# EAGLE schematic Ringo3-Eagle6 (EAGLE 6.2)
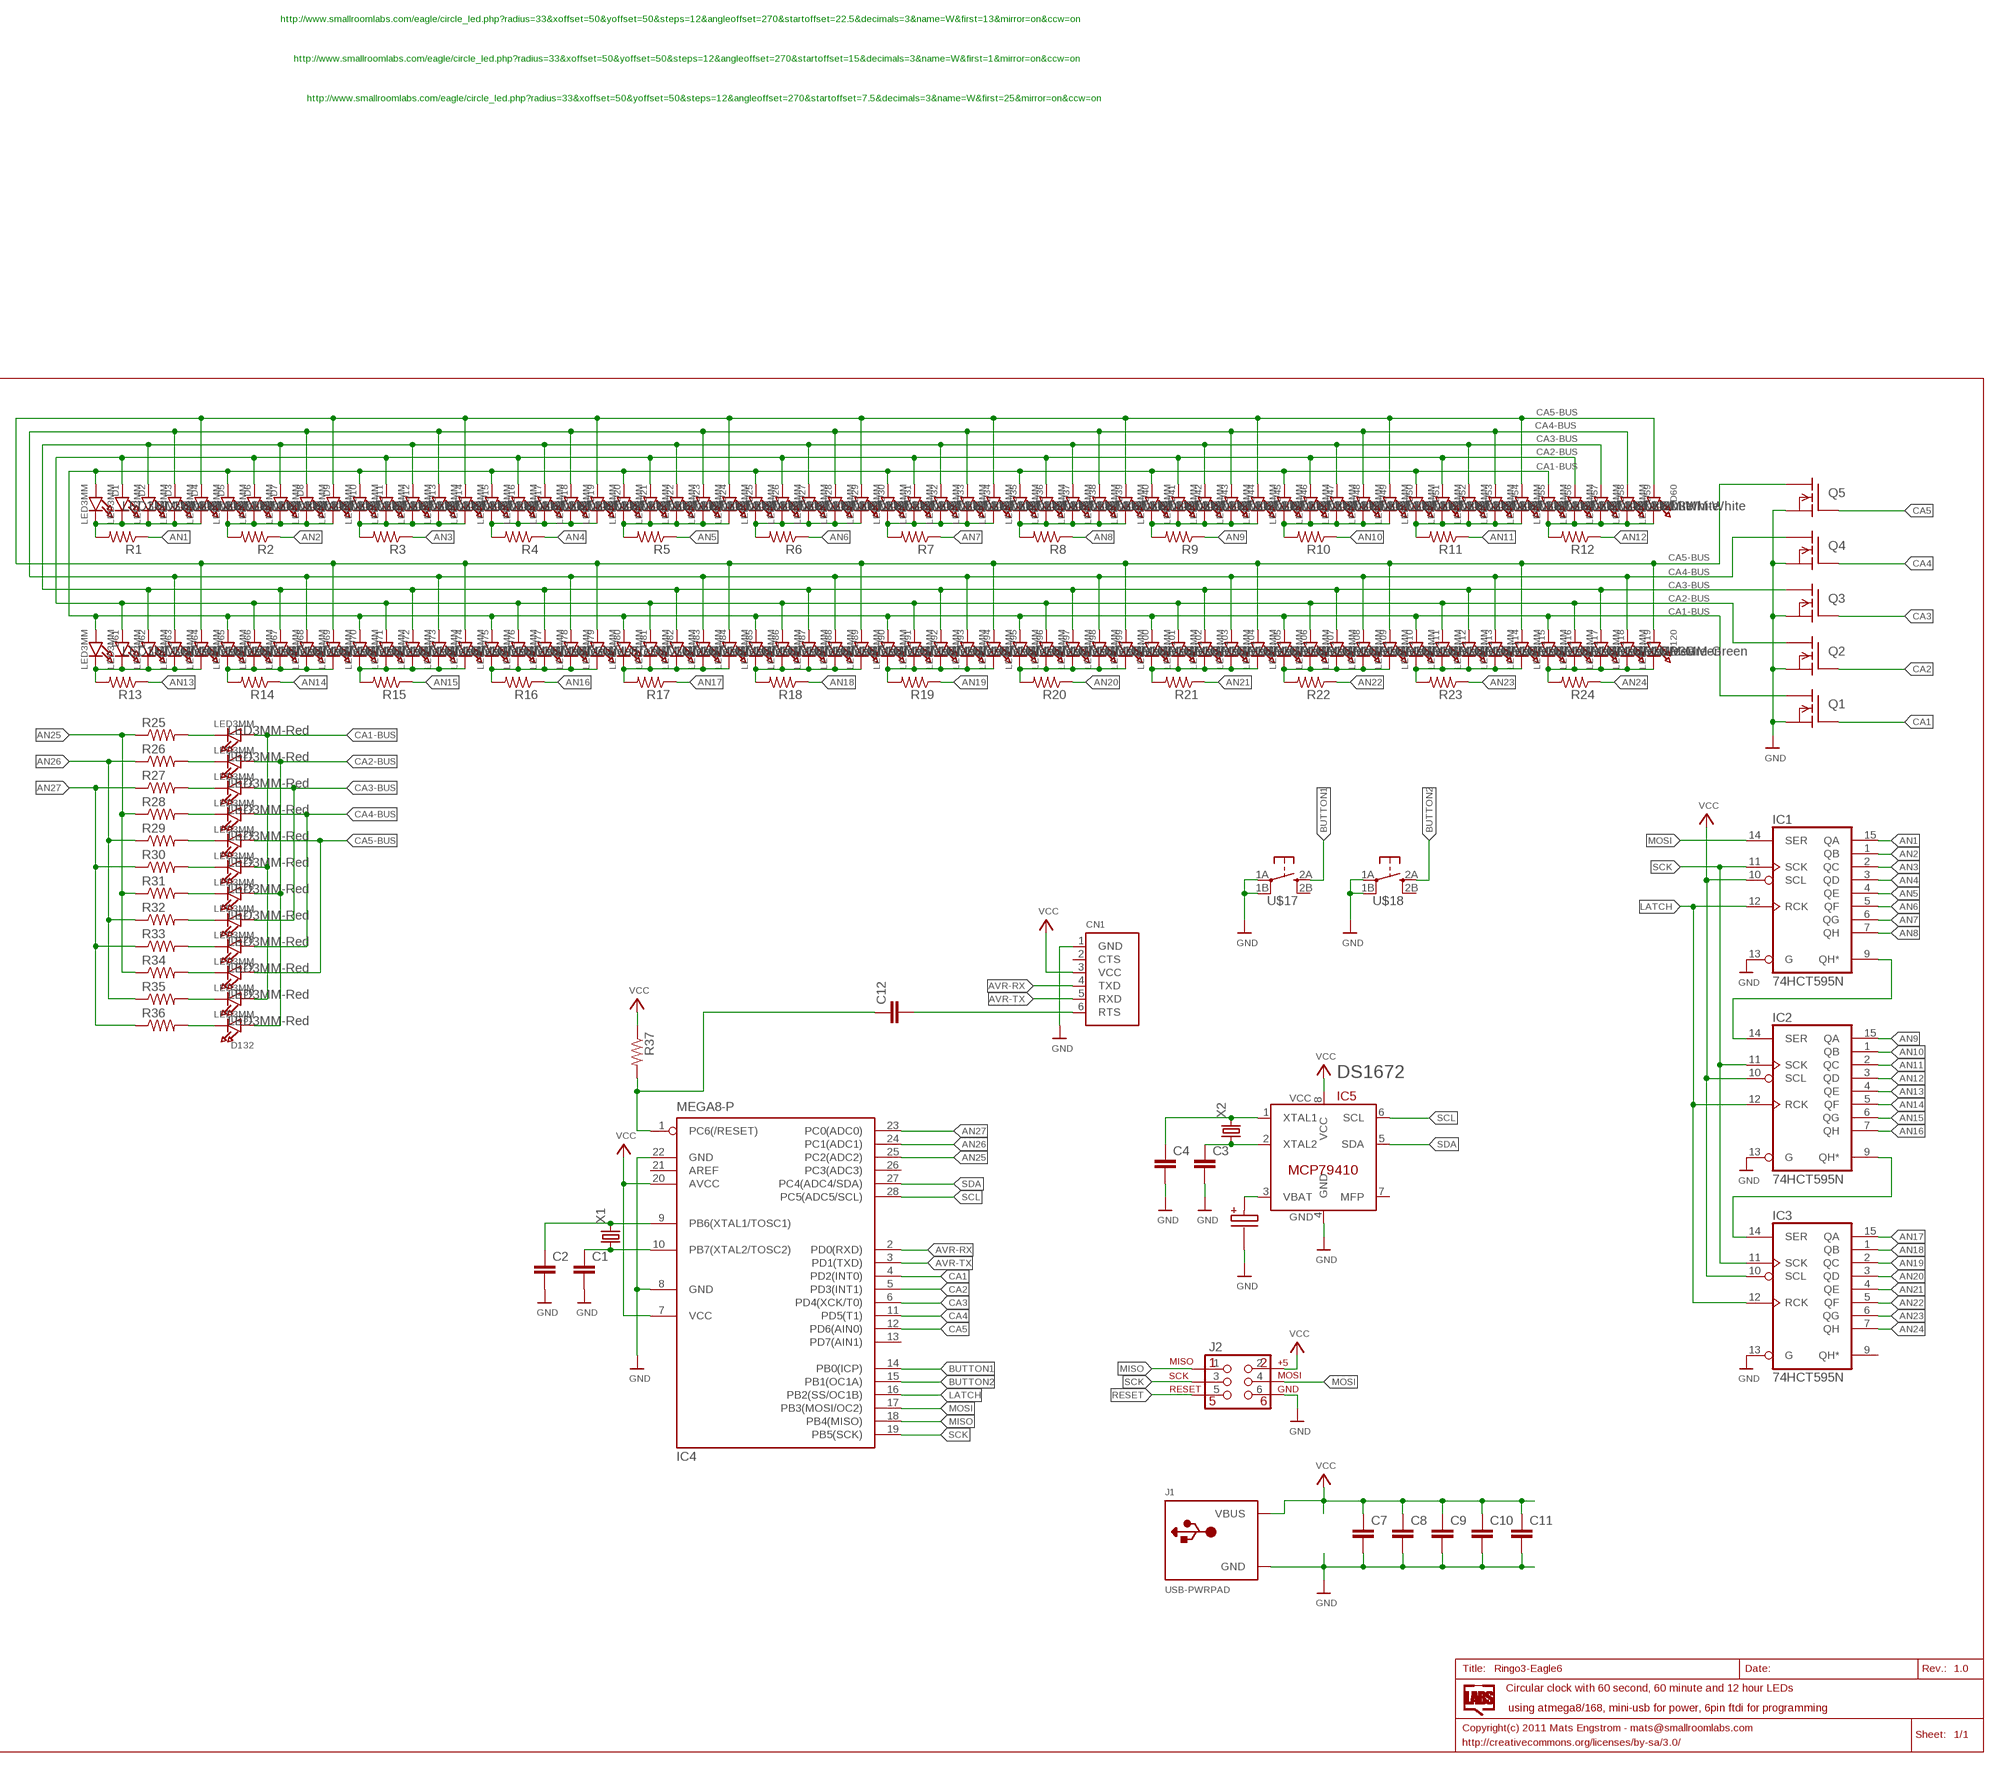
[diagram p0: schematic, sheet 1, part 1 of 2]
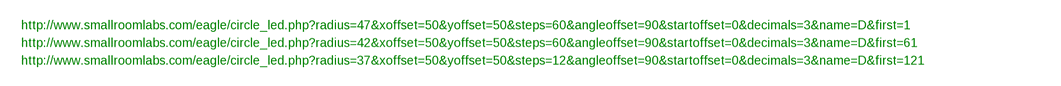
[diagram p1: schematic, sheet 1, part 2 of 2]

## Parts
C1  CAPPTH  [CAP-PTH-SMALL]
C2  CAPPTH  [CAP-PTH-SMALL]
C3  CAPPTH  [CAP-PTH-SMALL]
C4  CAPPTH  [CAP-PTH-SMALL]
C5  CAPPOLSUPER13/5  [CAP-SUPER13/5]
C7  CAPPTH  [CAP-PTH-SMALL]
C8  CAPPTH  [CAP-PTH-SMALL]
C9  CAPPTH  [CAP-PTH-SMALL]
C10  CAPPTH  [CAP-PTH-SMALL]
C11  CAPPTH  [CAP-PTH-SMALL]
C12  CAPPTH  [CAP-PTH-SMALL]
CN1  FTDIUSBCABLE  [1X06_ROUND]
D1  LED3MM  [LED3MM]
D2  LED3MM  [LED3MM]
D3  LED3MM  [LED3MM]
D4  LED3MM  [LED3MM]
D5  LED3MM  [LED3MM]
D6  LED3MM  [LED3MM]
D7  LED3MM  [LED3MM]
D8  LED3MM  [LED3MM]
D9  LED3MM  [LED3MM]
D10  LED3MM  [LED3MM]
D11  LED3MM  [LED3MM]
D12  LED3MM  [LED3MM]
D13  LED3MM  [LED3MM]
D14  LED3MM  [LED3MM]
D15  LED3MM  [LED3MM]
D16  LED3MM  [LED3MM]
D17  LED3MM  [LED3MM]
D18  LED3MM  [LED3MM]
D19  LED3MM  [LED3MM]
D20  LED3MM  [LED3MM]
D21  LED3MM  [LED3MM]
D22  LED3MM  [LED3MM]
D23  LED3MM  [LED3MM]
D24  LED3MM  [LED3MM]
D25  LED3MM  [LED3MM]
D26  LED3MM  [LED3MM]
D27  LED3MM  [LED3MM]
D28  LED3MM  [LED3MM]
D29  LED3MM  [LED3MM]
D30  LED3MM  [LED3MM]
D31  LED3MM  [LED3MM]
D32  LED3MM  [LED3MM]
D33  LED3MM  [LED3MM]
D34  LED3MM  [LED3MM]
D35  LED3MM  [LED3MM]
D36  LED3MM  [LED3MM]
D37  LED3MM  [LED3MM]
D38  LED3MM  [LED3MM]
D39  LED3MM  [LED3MM]
D40  LED3MM  [LED3MM]
D41  LED3MM  [LED3MM]
D42  LED3MM  [LED3MM]
D43  LED3MM  [LED3MM]
D44  LED3MM  [LED3MM]
D45  LED3MM  [LED3MM]
D46  LED3MM  [LED3MM]
D47  LED3MM  [LED3MM]
D48  LED3MM  [LED3MM]
D49  LED3MM  [LED3MM]
D50  LED3MM  [LED3MM]
D51  LED3MM  [LED3MM]
D52  LED3MM  [LED3MM]
D53  LED3MM  [LED3MM]
D54  LED3MM  [LED3MM]
D55  LED3MM  [LED3MM]
D56  LED3MM  [LED3MM]
D57  LED3MM  [LED3MM]
D58  LED3MM  [LED3MM]
D59  LED3MM  [LED3MM]
D60  LED3MM  [LED3MM]
D61  LED3MM  [LED3MM]
D62  LED3MM  [LED3MM]
D63  LED3MM  [LED3MM]
D64  LED3MM  [LED3MM]
D65  LED3MM  [LED3MM]
D66  LED3MM  [LED3MM]
D67  LED3MM  [LED3MM]
D68  LED3MM  [LED3MM]
D69  LED3MM  [LED3MM]
D70  LED3MM  [LED3MM]
D71  LED3MM  [LED3MM]
D72  LED3MM  [LED3MM]
D73  LED3MM  [LED3MM]
D74  LED3MM  [LED3MM]
D75  LED3MM  [LED3MM]
D76  LED3MM  [LED3MM]
D77  LED3MM  [LED3MM]
D78  LED3MM  [LED3MM]
D79  LED3MM  [LED3MM]
D80  LED3MM  [LED3MM]
D81  LED3MM  [LED3MM]
D82  LED3MM  [LED3MM]
D83  LED3MM  [LED3MM]
D84  LED3MM  [LED3MM]
D85  LED3MM  [LED3MM]
D86  LED3MM  [LED3MM]
D87  LED3MM  [LED3MM]
D88  LED3MM  [LED3MM]
D89  LED3MM  [LED3MM]
D90  LED3MM  [LED3MM]
D91  LED3MM  [LED3MM]
D92  LED3MM  [LED3MM]
D93  LED3MM  [LED3MM]
D94  LED3MM  [LED3MM]
D95  LED3MM  [LED3MM]
D96  LED3MM  [LED3MM]
D97  LED3MM  [LED3MM]
D98  LED3MM  [LED3MM]
D99  LED3MM  [LED3MM]
D100  LED3MM  [LED3MM]
D101  LED3MM  [LED3MM]
D102  LED3MM  [LED3MM]
D103  LED3MM  [LED3MM]
D104  LED3MM  [LED3MM]
D105  LED3MM  [LED3MM]
D106  LED3MM  [LED3MM]
D107  LED3MM  [LED3MM]
D108  LED3MM  [LED3MM]
D109  LED3MM  [LED3MM]
D110  LED3MM  [LED3MM]
D111  LED3MM  [LED3MM]
D112  LED3MM  [LED3MM]
D113  LED3MM  [LED3MM]
D114  LED3MM  [LED3MM]
D115  LED3MM  [LED3MM]
D116  LED3MM  [LED3MM]
D117  LED3MM  [LED3MM]
D118  LED3MM  [LED3MM]
D119  LED3MM  [LED3MM]
D120  LED3MM  [LED3MM]
D121  LED3MM  [LED3MM]
D122  LED3MM  [LED3MM]
D123  LED3MM  [LED3MM]
D124  LED3MM  [LED3MM]
D125  LED3MM  [LED3MM]
D126  LED3MM  [LED3MM]
D127  LED3MM  [LED3MM]
D128  LED3MM  [LED3MM]
D129  LED3MM  [LED3MM]
D130  LED3MM  [LED3MM]
D131  LED3MM  [LED3MM]
D132  LED3MM  [LED3MM]
IC1  74HCT595N  [DIL16]
IC2  74HCT595N  [DIL16]
IC3  74HCT595N  [DIL16]
IC4  MEGA8-P  [DIL28-3]
IC5  MCP79410DIL  [DIL08-LONG]
J1  USB-PWRPAD  [USB-MINIB-PTH-PWR-PAD]
J2  AVR-ISP6_TOUCH  [ISP-TOUCH]
Q1  N-FETSTR  [TO92-STRAIGHT]
Q2  N-FETSTR  [TO92-STRAIGHT]
Q3  N-FETSTR  [TO92-STRAIGHT]
Q4  N-FETSTR  [TO92-STRAIGHT]
Q5  N-FETSTR  [TO92-STRAIGHT]
R1  RESISTORAXIAL-0.3  [AXIAL-0.3]
R2  RESISTORAXIAL-0.3  [AXIAL-0.3]
R3  RESISTORAXIAL-0.3  [AXIAL-0.3]
R4  RESISTORAXIAL-0.3  [AXIAL-0.3]
R5  RESISTORAXIAL-0.3  [AXIAL-0.3]
R6  RESISTORAXIAL-0.3  [AXIAL-0.3]
R7  RESISTORAXIAL-0.3  [AXIAL-0.3]
R8  RESISTORAXIAL-0.3  [AXIAL-0.3]
R9  RESISTORAXIAL-0.3  [AXIAL-0.3]
R10  RESISTORAXIAL-0.3  [AXIAL-0.3]
R11  RESISTORAXIAL-0.3  [AXIAL-0.3]
R12  RESISTORAXIAL-0.3  [AXIAL-0.3]
R13  RESISTORAXIAL-0.3  [AXIAL-0.3]
R14  RESISTORAXIAL-0.3  [AXIAL-0.3]
R15  RESISTORAXIAL-0.3  [AXIAL-0.3]
R16  RESISTORAXIAL-0.3  [AXIAL-0.3]
R17  RESISTORAXIAL-0.3  [AXIAL-0.3]
R18  RESISTORAXIAL-0.3  [AXIAL-0.3]
R19  RESISTORAXIAL-0.3  [AXIAL-0.3]
R20  RESISTORAXIAL-0.3  [AXIAL-0.3]
R21  RESISTORAXIAL-0.3  [AXIAL-0.3]
R22  RESISTORAXIAL-0.3  [AXIAL-0.3]
R23  RESISTORAXIAL-0.3  [AXIAL-0.3]
R24  RESISTORAXIAL-0.3  [AXIAL-0.3]
R25  RESISTORAXIAL-0.3  [AXIAL-0.3]
R26  RESISTORAXIAL-0.3  [AXIAL-0.3]
R27  RESISTORAXIAL-0.3  [AXIAL-0.3]
R28  RESISTORAXIAL-0.3  [AXIAL-0.3]
R29  RESISTORAXIAL-0.3  [AXIAL-0.3]
R30  RESISTORAXIAL-0.3  [AXIAL-0.3]
R31  RESISTORAXIAL-0.3  [AXIAL-0.3]
R32  RESISTORAXIAL-0.3  [AXIAL-0.3]
R33  RESISTORAXIAL-0.3  [AXIAL-0.3]
R34  RESISTORAXIAL-0.3  [AXIAL-0.3]
R35  RESISTORAXIAL-0.3  [AXIAL-0.3]
R36  RESISTORAXIAL-0.3  [AXIAL-0.3]
R37  RESISTORAXIAL-0.3  [AXIAL-0.3]
U$17  TACTILETACT-4.5X4.5-PTH  [TACTILE-PTH-4.5X4.5]
U$18  TACTILETACT-4.5X4.5-PTH  [TACTILE-PTH-4.5X4.5]
X1  CRYSTALHC49US  [HC49US]
X2  CRYSTALTC26H  [TC26H]

## Nets
AN1: IC1.15(QA) R1.P$1
AN2: IC1.1(QB) R2.P$1
AN3: IC1.2(QC) R3.P$1
AN4: IC1.3(QD) R4.P$1
AN5: IC1.4(QE) R5.P$1
AN6: IC1.5(QF) R6.P$1
AN7: IC1.6(QG) R7.P$1
AN8: IC1.7(QH) R8.P$1
AN9: IC2.15(QA) R9.P$1
AN10: IC2.1(QB) R10.P$1
AN11: IC2.2(QC) R11.P$1
AN12: IC2.3(QD) R12.P$1
AN13: IC2.4(QE) R13.P$1
AN14: IC2.5(QF) R14.P$1
AN15: IC2.6(QG) R15.P$1
AN16: IC2.7(QH) R16.P$1
AN17: IC3.15(QA) R17.P$1
AN18: IC3.1(QB) R18.P$1
AN19: IC3.2(QC) R19.P$1
AN20: IC3.3(QD) R20.P$1
AN21: IC3.4(QE) R21.P$1
AN22: IC3.5(QF) R22.P$1
AN23: IC3.6(QG) R23.P$1
AN24: IC3.7(QH) R24.P$1
AN25: IC4.25(PC2(ADC2)) R25.P$1 R28.P$1 R31.P$1 R34.P$1
AN26: IC4.24(PC1(ADC1)) R26.P$1 R29.P$1 R32.P$1 R35.P$1
AN27: IC4.23(PC0(ADC0)) R27.P$1 R30.P$1 R33.P$1 R36.P$1
AVR-RX: CN1.4(TXD) IC4.2(PD0(RXD))
AVR-TX: CN1.5(RXD) IC4.3(PD1(TXD))
BUTTON1: IC4.14(PB0(ICP)) U$17.2A
BUTTON2: IC4.15(PB1(OC1A)) U$18.2A
CA1: IC4.4(PD2(INT0)) Q1.2(G)
CA1-BUS: D1.A D6.A D11.A D16.A D21.A D26.A D31.A D36.A D41.A D46.A D51.A D56.A D61.A D66.A D71.A D76.A D81.A D86.A D91.A D96.A D101.A D106.A D111.A D116.A D121.A D126.A D131.A Q1.3(D)
CA2: IC4.5(PD3(INT1)) Q2.2(G)
CA2-BUS: D2.A D7.A D12.A D17.A D22.A D27.A D32.A D37.A D42.A D47.A D52.A D57.A D62.A D67.A D72.A D77.A D82.A D87.A D92.A D97.A D102.A D107.A D112.A D117.A D122.A D127.A D132.A Q2.3(D)
CA3: IC4.6(PD4(XCK/T0)) Q3.2(G)
CA3-BUS: D3.A D8.A D13.A D18.A D23.A D28.A D33.A D38.A D43.A D48.A D53.A D58.A D63.A D68.A D73.A D78.A D83.A D88.A D93.A D98.A D103.A D108.A D113.A D118.A D123.A D128.A Q3.3(D)
CA4: IC4.11(PD5(T1)) Q4.2(G)
CA4-BUS: D4.A D9.A D14.A D19.A D24.A D29.A D34.A D39.A D44.A D49.A D54.A D59.A D64.A D69.A D74.A D79.A D84.A D89.A D94.A D99.A D104.A D109.A D114.A D119.A D124.A D129.A Q4.3(D)
CA5: IC4.12(PD6(AIN0)) Q5.2(G)
CA5-BUS: D5.A D10.A D15.A D20.A D25.A D30.A D35.A D40.A D45.A D50.A D55.A D60.A D65.A D70.A D75.A D80.A D85.A D90.A D95.A D100.A D105.A D110.A D115.A D120.A D125.A D130.A Q5.3(D)
DATA1: IC1.9(QH*) IC2.14(SER)
DATA2: IC2.9(QH*) IC3.14(SER)
GND [power]: C1.2 C2.2 C3.2 C4.2 C5.C C7.2 C8.2 C9.2 C10.2 C11.2 CN1.1(GND) IC1.13(G) IC2.13(G) IC3.13(G) IC4.8(GND) IC4.22(GND) IC5.4(GND) J1.GND J2.6(GND) Q1.1(S) Q2.1(S) Q3.1(S) Q4.1(S) Q5.1(S) U$17.1A U$17.1B U$18.1A U$18.1B
LATCH: IC1.12(RCK) IC2.12(RCK) IC3.12(RCK) IC4.16(PB2(SS/OC1B))
MISO: IC4.18(PB4(MISO)) J2.1(MISO)
MOSI: IC1.14(SER) IC4.17(PB3(MOSI/OC2)) J2.4(MOSI)
N$1: D1.C D2.C D3.C D4.C D5.C R1.P$2
N$2: D6.C D7.C D8.C D9.C D10.C R2.P$2
N$3: D21.C D22.C D23.C D24.C D25.C R5.P$2
N$4: D26.C D27.C D28.C D29.C D30.C R6.P$2
N$5: D31.C D32.C D33.C D34.C D35.C R7.P$2
N$6: D36.C D37.C D38.C D39.C D40.C R8.P$2
N$7: D11.C D12.C D13.C D14.C D15.C R3.P$2
N$8: D16.C D17.C D18.C D19.C D20.C R4.P$2
N$9: D41.C D42.C D43.C D44.C D45.C R9.P$2
N$10: D46.C D47.C D48.C D49.C D50.C R10.P$2
N$11: D51.C D52.C D53.C D54.C D55.C R11.P$2
N$12: D56.C D57.C D58.C D59.C D60.C R12.P$2
N$13: D116.C D117.C D118.C D119.C D120.C R24.P$2
N$14: D111.C D112.C D113.C D114.C D115.C R23.P$2
N$15: D106.C D107.C D108.C D109.C D110.C R22.P$2
N$16: D101.C D102.C D103.C D104.C D105.C R21.P$2
N$17: D96.C D97.C D98.C D99.C D100.C R20.P$2
N$18: C3.1 IC5.2(XTAL2) X2.1
N$19: D91.C D92.C D93.C D94.C D95.C R19.P$2
N$20: D86.C D87.C D88.C D89.C D90.C R18.P$2
N$21: D66.C D67.C D68.C D69.C D70.C R14.P$2
N$22: D71.C D72.C D73.C D74.C D75.C R15.P$2
N$23: D76.C D77.C D78.C D79.C D80.C R16.P$2
N$24: D81.C D82.C D83.C D84.C D85.C R17.P$2
N$25: D61.C D62.C D63.C D64.C D65.C R13.P$2
N$26: C4.1 IC5.1(XTAL1) X2.2
N$27: C12.2 CN1.6(RTS)
N$28: C5.A IC5.3(VBAT)
N$54: D121.C R25.P$2
N$55: D122.C R26.P$2
N$56: D123.C R27.P$2
N$57: D124.C R28.P$2
N$58: D125.C R29.P$2
N$59: D126.C R30.P$2
N$60: D127.C R31.P$2
N$61: D128.C R32.P$2
N$62: D129.C R33.P$2
N$63: D130.C R34.P$2
N$64: D131.C R35.P$2
N$65: D132.C R36.P$2
RESET: C12.1 IC4.1(PC6(/RESET)) J2.5(RESET) R37.P$2
SCK: IC1.11(SCK) IC2.11(SCK) IC3.11(SCK) IC4.19(PB5(SCK)) J2.3(SCK)
SCL: IC4.28(PC5(ADC5/SCL)) IC5.6(SCL)
SDA: IC4.27(PC4(ADC4/SDA)) IC5.5(SDA)
VCC [power]: C7.1 C8.1 C9.1 C10.1 C11.1 CN1.3(VCC) IC1.10(SCL) IC2.10(SCL) IC3.10(SCL) IC4.7(VCC) IC4.20(AVCC) IC5.8(VCC) J1.VBUS J2.2(V+) R37.P$1
XTAL1: C2.1 IC4.9(PB6(XTAL1/TOSC1)) X1.2
XTAL2: C1.1 IC4.10(PB7(XTAL2/TOSC2)) X1.1
Unconnected: CN1.2(CTS) IC3.9(QH*) IC4.13(PD7(AIN1)) IC4.21(AREF) IC4.26(PC3(ADC3)) IC5.7(MFP) U$17.2B U$18.2B

## Notes on the sheet
- http://www.smallroomlabs.com/eagle/circle_led.php?radius=33&xoffset=50&yoffset=50&steps=12&angleoffset=270&startoffset=22.5&decimals=3&name=W&first=13&mirror=on&ccw=on
- http://www.smallroomlabs.com/eagle/circle_led.php?radius=33&xoffset=50&yoffset=50&steps=12&angleoffset=270&startoffset=15&decimals=3&name=W&first=1&mirror=on&ccw=on
- http://www.smallroomlabs.com/eagle/circle_led.php?radius=33&xoffset=50&yoffset=50&steps=12&angleoffset=270&startoffset=7.5&decimals=3&name=W&first=25&mirror=on&ccw=on
- http://www.smallroomlabs.com/eagle/circle_led.php?radius=47&xoffset=50&yoffset=50&steps=60&angleoffset=90&startoffset=0&decimals=3&name=D&first=1
- http://www.smallroomlabs.com/eagle/circle_led.php?radius=42&xoffset=50&yoffset=50&steps=60&angleoffset=90&startoffset=0&decimals=3&name=D&first=61
- http://www.smallroomlabs.com/eagle/circle_led.php?radius=37&xoffset=50&yoffset=50&steps=12&angleoffset=90&startoffset=0&decimals=3&name=D&first=121
- DS1672
- Circular clock with 60 second, 60 minute and 12 hour LEDs
- using atmega8/168, mini-usb for power, 6pin ftdi for programming

## Power pins joined to a net without a drawn wire
GND: IC1.8(GND) IC2.8(GND) IC3.8(GND)
VCC: IC1.16(VCC) IC2.16(VCC) IC3.16(VCC)

## Library data of the parts
C1-C4 C7-C12 = SparkFun:CAP: Capacitor Standard 0603 ceramic capacitor, and 0.1" leaded capacitor.; EAGLEUP: CapSq2.54
C5 = SmallRoomLabs:CAPPOL
CN1 = microbuilder:FTDIUSBCABLE: FTDI TTL-232R USB Cable Connector for FTDI's USB->RS232 Cable
D1-D60 = SmallRoomLabs:LED; EAGLEUP: LED3MM-White
D61-D79 D81-D120 = SmallRoomLabs:LED; EAGLEUP: LED3MM-Green
D80 = SmallRoomLabs:LED
D121-D132 = SmallRoomLabs:LED; EAGLEUP: LED3MM-Red
IC1-IC3 = 74xx-eu:74*595: 8-bit SHIFT REGISTER, output latch
IC4 = atmel:MEGA8-P: MICROCONTROLLER 8 Kbytes FLASH, 1 kbytes SRAM, 512 bytes EEPROM, USART, 4-channel 10 bit ADC, 2-channel 8 bit ADC Pin compatible with Atmega48, ATMega88, ATMega168 Source: avr.lbr; OC_FARNELL: unknown; OC_NEWARK: unknown
IC5 = SmallRoomLabs:MCP79410; EAGLEUP: DIL08
J1 = SmallRoomLabs:USB-PWR; EAGLEUP: USBMINI
J2 = SmallRoomLabs:AVR-ISP6
Q1-Q3 Q5 = SmallRoomLabs:N-FET; EAGLEUP: TO92
Q4 = SmallRoomLabs:N-FET; EAGLEUP: TO92;R
R1-R37 = SparkFun:RESISTOR: Resistor Basic schematic elements and footprints for 0603, 1206, and PTH resistors.; EAGLEUP: 0204_7
U$17 U$18 = SmallRoomLabs:TACTILE; EAGLEUP: Tactile_4.5
X1 = SparkFun:CRYSTAL: Crystals Various standard crystals. Proven footprints. Spark Fun Electronics SKU : COM-00534; EAGLEUP: HC49U70
X2 = SparkFun:CRYSTAL: Crystals Various standard crystals. Proven footprints. Spark Fun Electronics SKU : COM-00534; EAGLEUP: TC38H

## Net classes
0 default: width 0.203 mm, drill 0.305 mm, clearance 0.203 mm
1 power: width 0.203 mm, drill 0.305 mm, clearance 0.203 mm